# EAGLE design moistureMeasure (EAGLE 6.4)
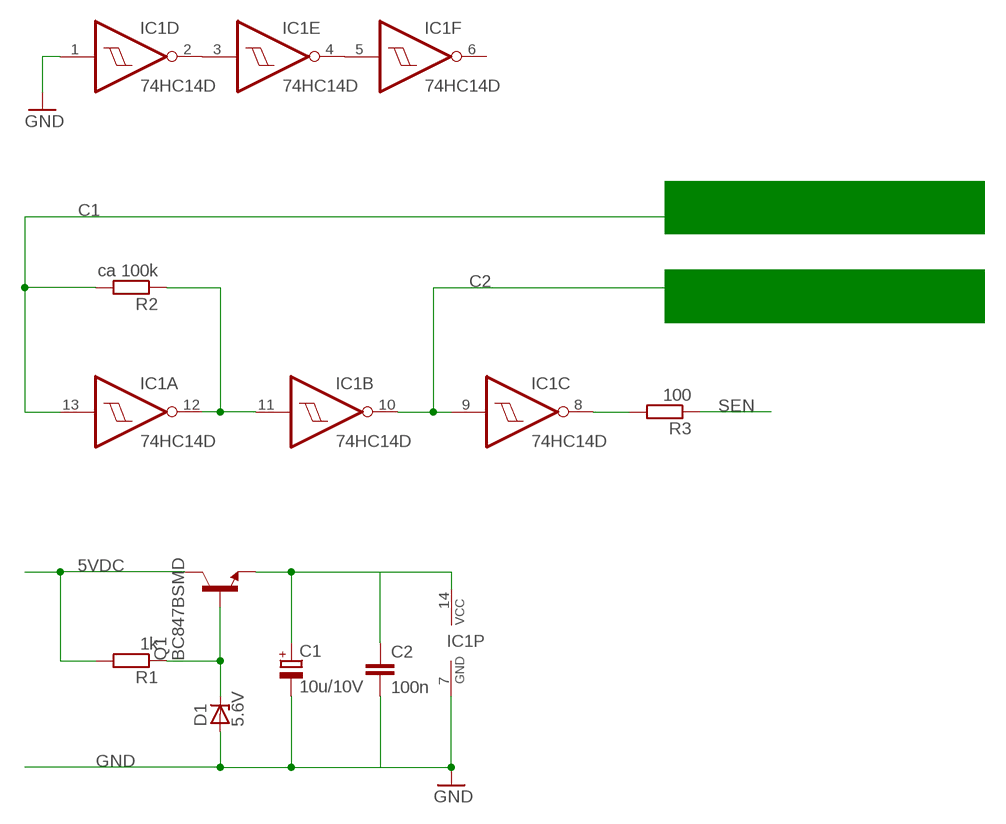
[diagram p0: schematic, sheet 1]

## Parts
C1  10u/10V  CPOL-EUA/3216-18W  [A/3216-18W]
C2  100n  C-EUC0805  [C0805]
D1  5.6V  ZENER-DIODESOD80C  [SOD80C]
IC1  74HC14D  [SO14]
Q1  BC847BSMD  [SOT23]
R1  1k  R-EU_R0805  [R0805]
R2  ca 100k  R-EU_R0805  [R0805]
R3  100  R-EU_R0805  [R0805]

## Nets
5VDC: Q1.3(C) R1.2
C1: IC1.13(A:I) R2.2
C2: IC1.9(C:I) IC1.10(B:O)
GND: C1.- C2.2 D1.A IC1.1(D:I) IC1.7(P:GND)
N$2: D1.C Q1.1(B) R1.1
N$3: C1.+ C2.1 IC1.14(P:VCC) Q1.2(E)
N$5: IC1.2(D:O) IC1.3(E:I)
N$6: IC1.4(E:O) IC1.5(F:I)
N$8: IC1.11(B:I) IC1.12(A:O) R2.1
N$10: IC1.8(C:O) R3.2
SEN: R3.1
Unconnected: IC1.6(F:O)

## Library data of the parts
C1 = rcl:CPOL-EU: POLARIZED CAPACITOR, European symbol
C2 = rcl:C-EU: CAPACITOR, European symbol
D1 = diode:ZENER-DIODE: Z-Diode
IC1 = 74xx-eu:74*14: Hex schmitt trigger INVERTER
Q1 = transistor-npn:BC847*: NPN Transistor
R1-R3 = rcl:R-EU_: RESISTOR, European symbol

## Board
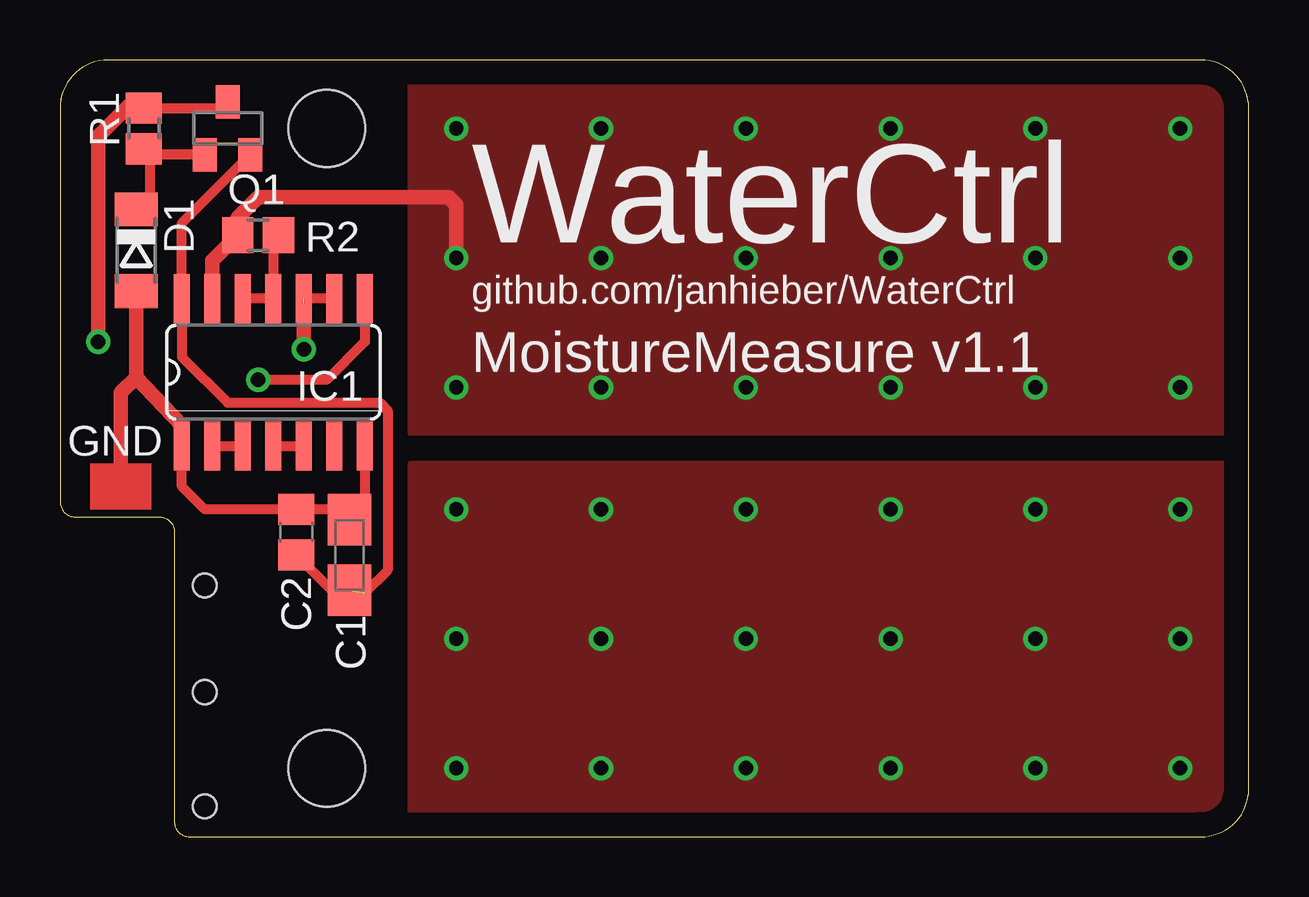
[diagram p1: board, top side]
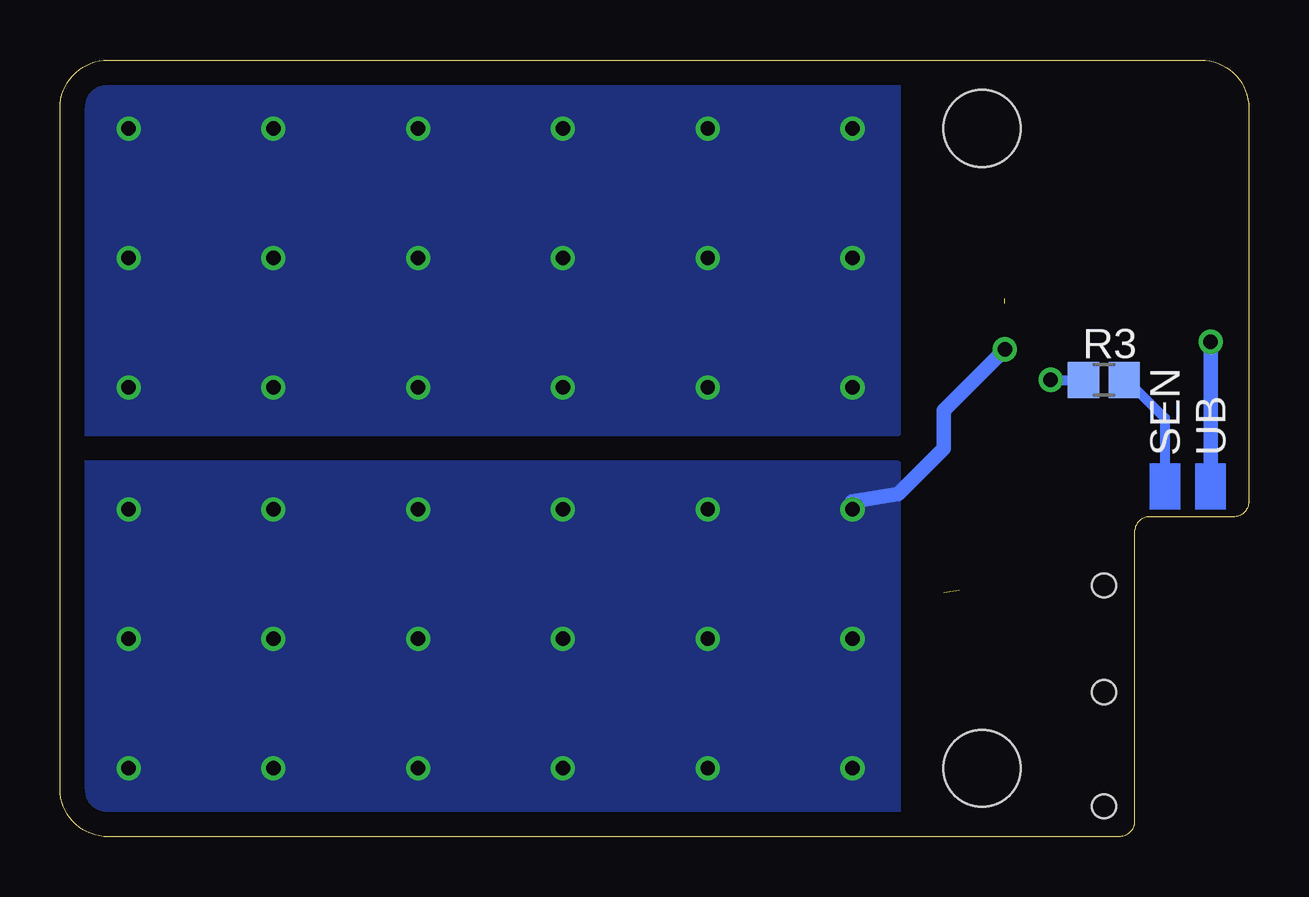
[diagram p2: board, bottom side, seen from below]

Size 49.53 x 32.38 mm. Coordinates in mm from the lower left corner, seen from the top.
Outline: 4.76,12.7 4.76,0.64 arc90 5.4,0 47.53,0 arc90 49.53,2 49.53,30.39 arc90 47.53,32.38 2,32.38 arc90 0,30.39 0,13.97 arc90 0.64,13.34 4.13,13.34 arc-90 4.76,12.7
Copper layers (1*16): Top 0.035mm / dielectric 1.5mm / Bottom 0.035mm
Design rules "default": minimum track width 10mil, minimum drill 24mil, track to track 8mil, track to pad 8mil, pad to pad 8mil, via to via 8mil, smd to smd 8mil, copper to edge 40mil, drill to drill 8mil, minimum pad ring 10mil, minimum via ring 8mil, stop-mask expansion 4mil, vias tented up to drill 0mil, thermal gap 10mil
Holes 1 mm at 6.03,1.27 6.03,6.03 6.03,10.48
Holes 3.2 mm at 11.11,29.53 11.11,2.86

### Footprints (pad centres in the part's own frame; a part is rotated, then mirrored left to right if it is on the bottom)
A/3216-18W = smd 2.15 x 1.8: + 1.475,0; - -1.475,0
C0805 = smd 1.3 x 1.5: 1 -0.95,0; 2 0.95,0
SOD80C = smd 1.4 x 1.8: A 1.7,0; C -1.7,0
SO14 = smd 0.66 x 2.032: 1 -3.81,-3.073; 2 -2.54,-3.073; 3 -1.27,-3.073; 4 0,-3.073; 5 1.27,-3.073; 6 2.54,-3.073; 7 3.81,-3.073; 8 3.81,3.073; 9 2.54,3.073; 10 1.27,3.073; 11 0,3.073; 12 -1.27,3.073; 13 -2.54,3.073; 14 -3.81,3.073
SOT23 = smd 1 x 1.4: 1 -0.95,-1.1; 2 0.95,-1.1; 3 0,1.1
R0805 = smd 1.3 x 1.5: 1 -0.85,0; 2 0.85,0

### Placement (x,y rotation side)
C1  12.06,11.75 270 top
C2  9.84,12.7 90 top
D1  3.17,24.45 270 top
IC1  8.89,19.37 0 top
Q1  6.99,29.53 0 top
R1  3.49,29.53 90 top
R2  8.26,25.08 180 top
R3  6.03,19.05 180 bottom

### Tracks (layer width: path | path; a pad name or v marks a point on that pad's centre or on a via)
5VDC  (via drill 0.6)
  Top 0.406: 6.99,30.16 Q1.3 6.74,30.38 R1.2 3.39,30.48 2.86,30.48
  Top 0.61: v1.59,20.64 1.59,29.21 2.86,30.48
  Bottom 0.61: v1.59,20.64 1.59,14.92
C1  (via drill 0.6)
  Top 0.61: v16.51,24.13 16.51,26.35 16.19,26.67 8.26,26.67 7.41,25.82 R2.2 6.35,24.03 IC1.13
  other vias: 28.57,24.13 16.51,29.53 22.54,29.53 22.54,24.13 16.51,18.73 22.54,18.73 34.61,24.13 28.57,18.73 40.64,24.13 40.64,18.73 34.61,18.73 28.57,29.53 34.61,29.53 40.64,29.53 46.67,29.53 46.67,24.13 46.67,18.73
  pour Top (isolate 0.254): 14.61,31.75 46.9,31.75 arc-90 48.9,29.75 48.9,16.83 14.61,16.83
  pour Bottom (isolate 0.254): 14.61,31.75 46.9,31.75 arc-90 48.9,29.75 48.9,16.83 14.61,16.83
C2  (via drill 0.6)  (1 unrouted)
  Top 0.406: IC1.9 IC1.10
  Top 0.61: 10.16,22.23 v10.16,20.32
  Bottom 0.61: v10.16,20.32 12.7,17.78 12.7,16.19 14.61,14.29 16.51,13.97
  other vias: 16.51,13.65 22.54,13.65 28.57,13.65 34.61,13.65 40.64,13.65 46.67,13.65 16.51,8.26 22.54,8.26 28.57,8.26 34.61,8.26 40.64,8.26 46.67,8.26 16.51,2.86 22.54,2.86 28.57,2.86 34.61,2.86 40.64,2.86 46.67,2.86
  pour Bottom (isolate 0.254): 14.61,15.56 48.9,15.56 48.9,2.63 arc-90 46.9,0.64 14.61,0.64
  pour Top (isolate 0.254): 14.61,15.56 48.9,15.56 48.9,2.63 arc-90 46.9,0.64 14.61,0.64
GND
  Top 0.406: IC1.7 12.7,13.22 C1.- 12.06,13.65 C2.2 6.04,13.65 5.08,14.61 IC1.1
  Top 0.61: D1.A 3.17,19.15 | 3.17,19.15 5.08,17.14 IC1.1 | 3.17,19.15 2.54,18.52 2.54,14.92
N$2
  Top 0.406: Q1.1 3.74,28.43 | 3.74,28.43 R1.1 | 3.74,28.43 3.74,26.71 D1.C
N$3  (1 unrouted)
  Top 0.406: Q1.2 5.08,25.57 IC1.14 5.08,20 6.99,18.1 13.34,18.1 13.65,17.78 13.65,11.11 12.7,10.16 | C2.1 11.32,10.27 C1.+
N$5
  Top 0.406: IC1.2 IC1.3
N$6
  Top 0.406: IC1.4 IC1.5
N$8
  Top 0.406: IC1.11 IC1.12 | IC1.11 8.79,22.54 | R2.1 8.89,24.87 IC1.11
N$10  (via drill 0.6)
  Top 0.406: IC1.8 12.7,20.64 11.11,19.05 v8.26,19.05
  Bottom 0.406: v8.26,19.05 R3.2
N$11
  Top 0.406: 9.21,25.08 8.89,24.77
SEN
  Bottom 0.406: R3.1 5.08,19.05 3.49,17.46 3.49,15.24
(copper drawn outside any net)
  shapes: Bottom area x2, Top area x1

### Text on the board
tNames: WaterCtrl | github.com/janhieber/WaterCtrl | MoistureMeasure v1.1 | GND
bNames: UB | SEN